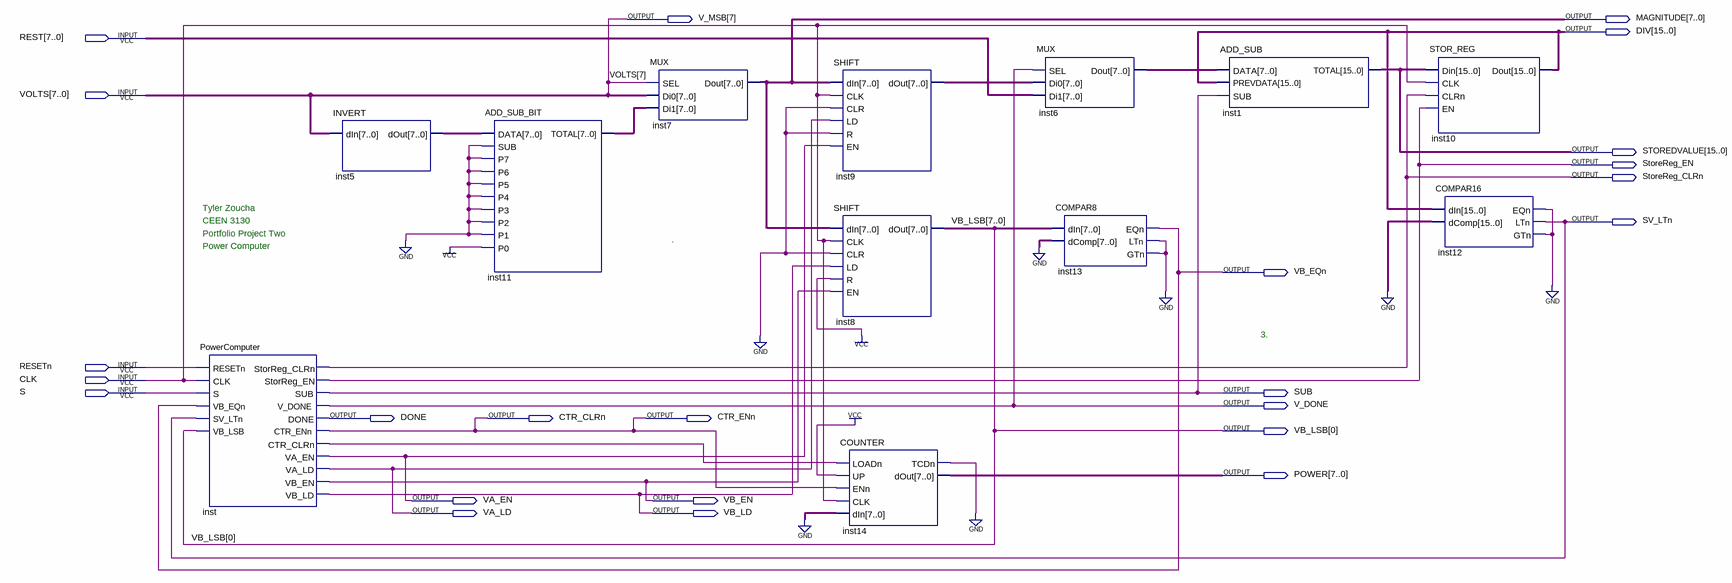
[diagram p0: schematic sheet]
// Quartus schematic Block1.bdf as structural Verilog: 12 symbols, 24 pins
module Block1 (
  input  [7:0] REST,
  input  [7:0] VOLTS,
  input  RESETn,
  input  CLK,
  input  S,
  output [7:7] V_MSB,
  output [7:0] MAGNITUDE,
  output [15:0] DIV,
  output [15:0] STOREDVALUE,
  output StoreReg_EN,
  output StoreReg_CLRn,
  output SV_LTn,
  output VB_EQn,
  output SUB,
  output V_DONE,
  output DONE,
  output CTR_CLRn,
  output CTR_ENn,
  output [7:0] VB_LSB,
  output [7:0] POWER,
  output VA_EN,
  output VB_EN,
  output VA_LD,
  output VB_LD
);

  wire inst12_eqn, inst13_ltn, inst14_tcdn, inst_ctr_clrn;
  wire [7:0] inst5_dout, inst6_dout, inst9_dout, inst11_total;

  PowerComputer inst (
    .RESETn(RESETn), .CLK(CLK), .S(S), .VB_EQn(VB_EQn), .SV_LTn(SV_LTn), .VB_LSB(VB_LSB[0]),
    .StorReg_CLRn(StoreReg_CLRn), .StorReg_EN(StoreReg_EN), .SUB(SUB), .V_DONE(V_DONE), .DONE(DONE),
    .CTR_ENn(CTR_CLRn), .CTR_CLRn(inst_ctr_clrn), .VA_EN(VA_EN), .VA_LD(VA_LD), .VB_EN(VB_EN), .VB_LD(VB_LD));
  INVERT inst5 (.dIn(VOLTS), .dOut(inst5_dout));
  ADD_SUB_BIT inst11 (
    .DATA(inst5_dout), .SUB(1'b0), .P7(1'b0), .P6(1'b0), .P5(1'b0), .P4(1'b0), .P3(1'b0), .P2(1'b0),
    .P1(1'b0), .P0(1'b1), .TOTAL(inst11_total));
  MUX inst7 (.SEL(VOLTS[7]), .Di0(VOLTS), .Di1(inst11_total), .Dout(MAGNITUDE));
  SHIFT inst9 (.dIn(MAGNITUDE), .CLK(CLK), .CLR(1'b0), .LD(VA_LD), .R(1'b0), .EN(VA_EN), .dOut(inst9_dout));
  SHIFT inst8 (.dIn(MAGNITUDE), .CLK(CLK), .CLR(1'b0), .LD(VB_LD), .R(1'b1), .EN(VB_EN), .dOut(VB_LSB));
  COUNTER inst14 (
    .LOADn(inst_ctr_clrn), .UP(1'b1), .ENn(CTR_CLRn), .CLK(CLK), .dIn({8{1'b0}}), .TCDn(inst14_tcdn),
    .dOut(POWER));
  MUX inst6 (.SEL(V_DONE), .Di0(inst9_dout), .Di1(REST), .Dout(inst6_dout));
  COMPAR8 inst13 (.dIn(VB_LSB), .dComp({8{1'b0}}), .EQn(VB_EQn), .LTn(inst13_ltn), .GTn(inst13_ltn));
  ADD_SUB inst1 (.DATA(inst6_dout), .PREVDATA(DIV), .SUB(SUB), .TOTAL(STOREDVALUE));
  STOR_REG inst10 (.Din(STOREDVALUE), .CLK(CLK), .CLRn(StoreReg_CLRn), .EN(StoreReg_EN), .Dout(DIV));
  COMPAR16 inst12 (.dIn(DIV), .dComp({16{1'b0}}), .EQn(inst12_eqn), .LTn(SV_LTn), .GTn(inst12_eqn));

  assign CTR_ENn = CTR_CLRn;
  assign V_MSB[7] = VOLTS[7];
  // also tied to GND on the sheet: {inst12_eqn, inst14_tcdn, inst13_ltn}

  // Notes on the sheet:
  //   Tyler Zoucha
  //   CEEN 3130
  //   Portfolio Project Two
  //   .
  //   Power Computer
  //   3.
endmodule
